# Altium project ECU V1.0 B.PrjPcb (part 14 of 14)
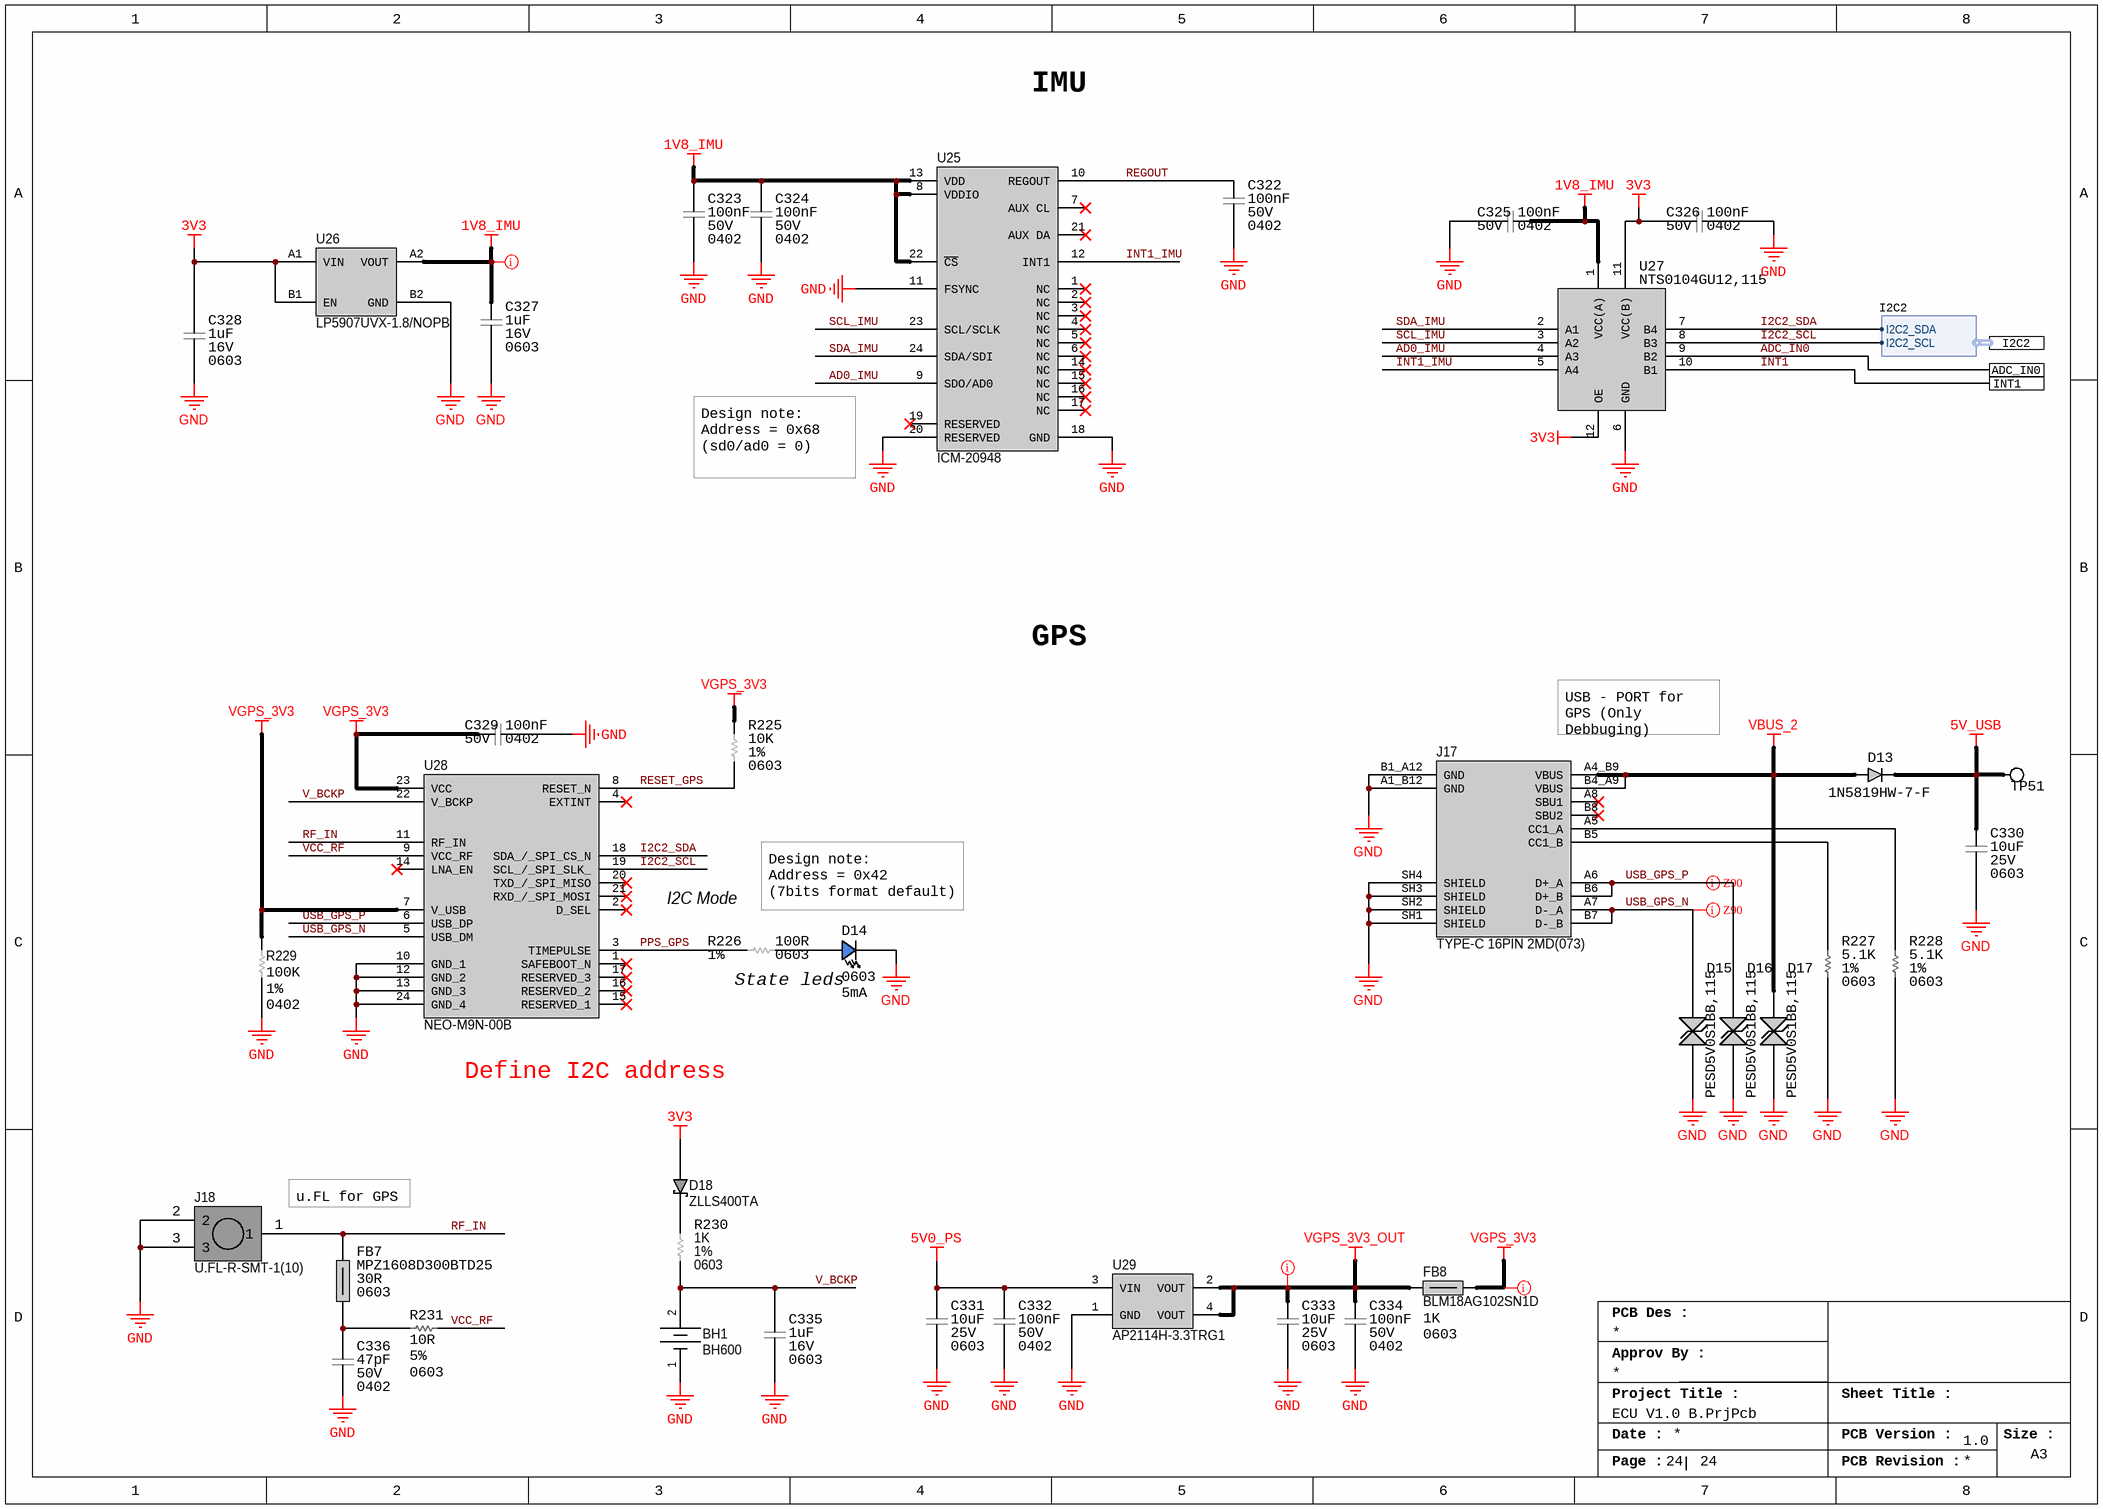
[diagram p22: 23_IMU_GPS.SchDoc]

## Nets that join several sheets
1V8: 03_iMX 8X_PMIC (R237.2), 20_V2X_MODEM (C303.2 R177.1 U18.1), 17_CAN_BUS (C250.2 R96.2 U8.1), 18_ETH (R123.2), 19_WIFI_BLE (15 pins), 07_iMX 8X_LPDDR4 (L6.1), 11_iMX 8X_SPI & ADC (12 pins), 05_iMX 8X_PCIE (5 pins), 13_iMX 8X_SYSTEM (J4.3 J5.3), 21_GPIOs_EXP (R199.2 R217.2)
3V3: 20_V2X_MODEM (13 pins), 17_CAN_BUS (5 pins), 18_ETH (7 pins), 19_WIFI_BLE (29 pins), 02_PWR IN (R233.2), 09_iMX 8X_SD CARD & V2X (7 pins), 11_iMX 8X_SPI & ADC (L7.1), 05_iMX 8X_PCIE (C83.2 C84.2 U1.L9), 13_iMX 8X_SYSTEM (R241.1), 21_GPIOs_EXP (41 pins), 23_IMU_GPS (7 pins)
3V3_PS: 03_iMX 8X_PMIC (R232.1), 02_PWR IN (22 pins)
5V0_PS: 03_iMX 8X_PMIC (C45.2 U2.19), 20_V2X_MODEM (R179.1 R180.2), 17_CAN_BUS (C245.2 C246.2 C247.1 U7.3), 02_PWR IN (22 pins), 23_IMU_GPS (C331.2 C332.2 U29.3)
12V0: 20_V2X_MODEM (R178.2), 02_PWR IN (11 pins)
GND: 03_iMX 8X_PMIC (44 pins), 20_V2X_MODEM (44 pins), 17_CAN_BUS (33 pins), 18_ETH (41 pins), 19_WIFI_BLE (68 pins), 02_PWR IN (62 pins), 07_iMX 8X_LPDDR4 (18 pins), 09_iMX 8X_SD CARD & V2X (7 pins), 11_iMX 8X_SPI & ADC (15 pins), 05_iMX 8X_PCIE (10 pins), 13_iMX 8X_SYSTEM (15 pins), 21_GPIOs_EXP (8 pins), 23_IMU_GPS (41 pins)
PMIC_VDD_DDRIO: 03_iMX 8X_PMIC (7 pins), 02_PWR IN (R236.2)
ADC_IN0: 11_iMX 8X_SPI & ADC (U1.AD34), 23_IMU_GPS (U27.9)
BT_DIS_B: 19_WIFI_BLE (J13.54), 21_GPIOs_EXP (R201.1 U23.4)
BT_UART_WAKE_B: 19_WIFI_BLE (J13.20), 21_GPIOs_EXP (R202.1 U23.5)
ENET0_AUX_GPIO1: 20_V2X_MODEM (U20.13), 21_GPIOs_EXP (R204.1 U23.7)
ENET0_AUX_GPIO2: 20_V2X_MODEM (U20.12), 21_GPIOs_EXP (R205.1 U23.8)
ENET0_AUX_GPIO3: 20_V2X_MODEM (U20.11), 21_GPIOs_EXP (R206.1 U23.9)
ENET0_AUX_GPIO4: 20_V2X_MODEM (U20.10), 21_GPIOs_EXP (R207.1 U23.10)
ENET0_MDC: 20_V2X_MODEM (J14.50), 09_iMX 8X_SD CARD & V2X (U1.E33)
ENET0_MDIO: 20_V2X_MODEM (J14.48), 09_iMX 8X_SD CARD & V2X (U1.E35)
ENET0_MODULE_INH: 20_V2X_MODEM (J14.43), 21_GPIOs_EXP (R184.1 U22.5)
ENET0_MODULE_RST_B: 20_V2X_MODEM (R174.2), 21_GPIOs_EXP (R183.1 U22.4)
ENET0_REFCLK: 20_V2X_MODEM (J14.04 U17.4), 09_iMX 8X_SD CARD & V2X (R46.2)
ENET0_RGMII_RX_CTL: 20_V2X_MODEM (J14.28), 09_iMX 8X_SD CARD & V2X (U1.C33)
ENET0_RGMII_RXC: 20_V2X_MODEM (J14.32), 09_iMX 8X_SD CARD & V2X (U1.B34)
ENET0_RGMII_RXD0: 20_V2X_MODEM (J14.36), 09_iMX 8X_SD CARD & V2X (U1.B32)
ENET0_RGMII_RXD1: 20_V2X_MODEM (J14.38), 09_iMX 8X_SD CARD & V2X (U1.A33)
ENET0_RGMII_RXD2: 20_V2X_MODEM (J14.42), 09_iMX 8X_SD CARD & V2X (U1.C31)
ENET0_RGMII_RXD3: 20_V2X_MODEM (J14.44), 09_iMX 8X_SD CARD & V2X (U1.A31)
ENET0_RGMII_TX_CTL: 20_V2X_MODEM (J14.24), 09_iMX 8X_SD CARD & V2X (U1.C35)
ENET0_RGMII_TXC: 20_V2X_MODEM (J14.20), 09_iMX 8X_SD CARD & V2X (U1.G27)
ENET0_RGMII_TXD0: 20_V2X_MODEM (J14.16), 09_iMX 8X_SD CARD & V2X (U1.J29)
ENET0_RGMII_TXD1: 20_V2X_MODEM (J14.14), 09_iMX 8X_SD CARD & V2X (U1.G29)
ENET0_RGMII_TXD2: 20_V2X_MODEM (J14.10), 09_iMX 8X_SD CARD & V2X (U1.L29)
ENET0_RGMII_TXD3: 20_V2X_MODEM (J14.08), 09_iMX 8X_SD CARD & V2X (U1.N29)
ENET1_PHY_RST_B: 18_ETH (D8.1), 21_GPIOs_EXP (R185.1 U22.6)
I2C2_SCL: 11_iMX 8X_SPI & ADC (U1.AR17), 21_GPIOs_EXP (U22.22 U23.22), 23_IMU_GPS (U27.8 U28.19)
I2C2_SDA: 11_iMX 8X_SPI & ADC (U1.AP16), 21_GPIOs_EXP (U22.23 U23.23), 23_IMU_GPS (U27.7 U28.18)
I2C3_SCL: 20_V2X_MODEM (J14.54), 19_WIFI_BLE (U10.13), 02_PWR IN (R68.1 U3.2), 11_iMX 8X_SPI & ADC (U1.AP18)
I2C3_SDA: 20_V2X_MODEM (J14.52), 19_WIFI_BLE (U10.12), 02_PWR IN (R69.1 U3.3), 11_iMX 8X_SPI & ADC (U1.AR15)
INT1: 21_GPIOs_EXP (R203.1 U23.6), 23_IMU_GPS (U27.10)
PCI_CLK_SEL: 19_WIFI_BLE (R154.2 U11.12 U13.12), 21_GPIOs_EXP (R193.1 U22.15)
PCIE0_RX_N: 19_WIFI_BLE (R152.1), 05_iMX 8X_PCIE (U1.B12)
PCIE0_RX_P: 19_WIFI_BLE (R151.1), 05_iMX 8X_PCIE (U1.A13)
PCIE0_TX_N: 19_WIFI_BLE (C283.2), 05_iMX 8X_PCIE (U1.B10)
PCIE0_TX_P: 19_WIFI_BLE (C282.2), 05_iMX 8X_PCIE (U1.A11)
PCIE_CTRL_CLKREQ_B: 19_WIFI_BLE (R168.1 U15.1), 05_iMX 8X_PCIE (U1.C9)
PCIE_CTRL_PERST_B: 19_WIFI_BLE (R153.1), 05_iMX 8X_PCIE (U1.B8)
PCIE_CTRL_WAKE_B: 19_WIFI_BLE (J13.55 R150.1), 05_iMX 8X_PCIE (U1.A9)
PCIE_REF_CLK_N: 19_WIFI_BLE (R137.1), 05_iMX 8X_PCIE (R32.2)
PCIE_REF_CLK_P: 19_WIFI_BLE (R136.1), 05_iMX 8X_PCIE (R31.2)
PMIC_I2C_SCL: 03_iMX 8X_PMIC (U2.11), 13_iMX 8X_SYSTEM (R59.1 U1.AP30)
PMIC_I2C_SDA: 03_iMX 8X_PMIC (U2.10), 13_iMX 8X_SYSTEM (R60.1 U1.AP28)
PMIC_INT_B: 03_iMX 8X_PMIC (R18.1), 13_iMX 8X_SYSTEM (U1.AN27)
PMIC_ON_REQ: 03_iMX 8X_PMIC (R17.1), 13_iMX 8X_SYSTEM (R57.1 U1.AR19)
PMIC_STBY: 03_iMX 8X_PMIC (R15.1), 13_iMX 8X_SYSTEM (U1.AN25)
PMIC_WDOG_IN: 03_iMX 8X_PMIC (R19.1), 13_iMX 8X_SYSTEM (U1.AG29)
SPI0_CS0: 19_WIFI_BLE (R138.1), 11_iMX 8X_SPI & ADC (U1.AB34)
SPI0_CS1: 19_WIFI_BLE (R139.1), 11_iMX 8X_SPI & ADC (U1.AC35)
SPI0_SCK: 19_WIFI_BLE (R140.1), 11_iMX 8X_SPI & ADC (U1.Y34)
SPI0_SDI: 19_WIFI_BLE (R141.1), 11_iMX 8X_SPI & ADC (U1.AA33)
SPI0_SDO: 19_WIFI_BLE (R142.1), 11_iMX 8X_SPI & ADC (U1.AA35)
SPI2_CS0: 20_V2X_MODEM (U19.11), 09_iMX 8X_SD CARD & V2X (U1.C29)
SPI2_SCK: 20_V2X_MODEM (U19.10), 09_iMX 8X_SD CARD & V2X (U1.A29)
SPI2_SD0: 20_V2X_MODEM (U19.13), 09_iMX 8X_SD CARD & V2X (U1.B28)
SPI2_SDI: 20_V2X_MODEM (U19.12), 09_iMX 8X_SD CARD & V2X (U1.B30)
SS_CNTRL: 19_WIFI_BLE (U14.2), 21_GPIOs_EXP (R198.1 R200.2 U22.20)
UART1_CTS_B: 19_WIFI_BLE (J13.34), 11_iMX 8X_SPI & ADC (U1.AA29)
UART1_RTS_B: 19_WIFI_BLE (J13.36), 11_iMX 8X_SPI & ADC (U1.W29)
UART1_RX: 19_WIFI_BLE (J13.22), 11_iMX 8X_SPI & ADC (U1.W33)
UART1_TX: 19_WIFI_BLE (J13.32), 11_iMX 8X_SPI & ADC (U1.W35)
V2X_PMIC_STBY: 20_V2X_MODEM (U21.2), 21_GPIOs_EXP (R210.1 U23.14)
WIFI_DIS_B: 19_WIFI_BLE (J13.56), 21_GPIOs_EXP (R196.1 U22.18)
WIFI_EN: 19_WIFI_BLE (U10.10), 21_GPIOs_EXP (R195.1 U22.17)
WIFI_WAKE_B: 19_WIFI_BLE (U10.11), 21_GPIOs_EXP (R197.1 U22.19)

## Assembly variants
Base Variant: not fitted C12 C13 C14 C15 C82 C271 C272 C340 D9 D10 D11 D12 D13 D14 D15 D16 J16 J16 R6 R8 R9 R14 R21 R22 R35 R36 R44 R44 R57 R70 R71 R73 R74 R89 R93 R98 R102 R103 R104 R105 R106 R107 R107 R108 R111 R112 R115 R119 R126 R127 R154 R163 R177 R178